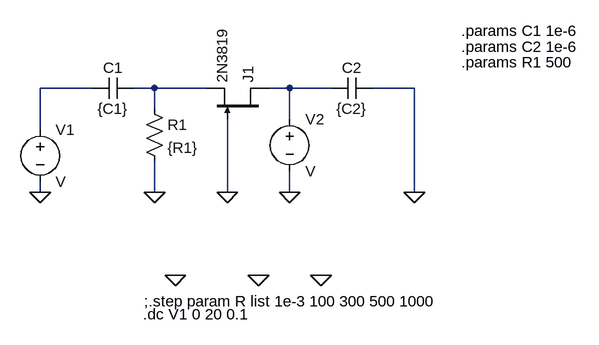
[diagram p0: schematic autopolarizacion2_2N3819.asc]
autopolarizacion2_2N3819.asc, the LTspice schematic file:
Version 4
SHEET 1 880 680
WIRE -80 48 -160 48
WIRE 16 48 -16 48
WIRE 96 48 16 48
WIRE 224 48 192 48
WIRE 288 48 224 48
WIRE 416 48 352 48
WIRE 16 80 16 48
WIRE 224 96 224 48
WIRE -160 112 -160 48
WIRE -160 208 -160 192
WIRE 16 208 16 160
WIRE 128 208 128 96
WIRE 224 208 224 176
WIRE 416 208 416 48
FLAG 272 336 0
FLAG 176 336 0
FLAG 48 336 0
FLAG 416 208 0
FLAG 224 208 0
FLAG 128 208 0
FLAG 16 208 0
FLAG -160 208 0
SYMBOL njf 192 96 M270
SYMATTR InstName J1
SYMATTR Value 2N3819
SYMBOL res 0 64 R0
SYMATTR InstName R1
SYMATTR Value {R1}
SYMBOL voltage -160 96 R0
SYMATTR InstName V1
SYMBOL cap -16 32 R90
WINDOW 0 0 32 VBottom 2
WINDOW 3 32 32 VTop 2
SYMATTR InstName C1
SYMATTR Value {C1}
SYMBOL cap 352 32 R90
WINDOW 0 0 32 VBottom 2
WINDOW 3 32 32 VTop 2
SYMATTR InstName C2
SYMATTR Value {C2}
SYMBOL voltage 224 80 R0
SYMATTR InstName V2
TEXT 0 376 Left 2 !;.step param R list 1e-3 100 300 500 1000
TEXT -2 396 Left 2 !.dc V1 0 20 0.1
TEXT 488 -40 Left 2 !.params C1 1e-6
TEXT 488 -16 Left 2 !.params C2 1e-6
TEXT 488 8 Left 2 !.params R1 500

The netlist it stands for:
* autopolarizacion2_2N3819.asc
J1 N003 0 N002 2N3819
R1 N002 0 {R1}
V1 N001 0 V
C1 N002 N001 {C1}
C2 0 N003 {C2}
V2 N003 0 V
.model NJF NJF
.model PJF PJF
.lib standard.jft
;.step param R list 1e-3 100 300 500 1000
.dc V1 0 20 0.1
.params C1 1e-6
.params C2 1e-6
.params R1 500
.backanno
.end